# EAGLE schematic open-lux-m (EAGLE 6.5.0)
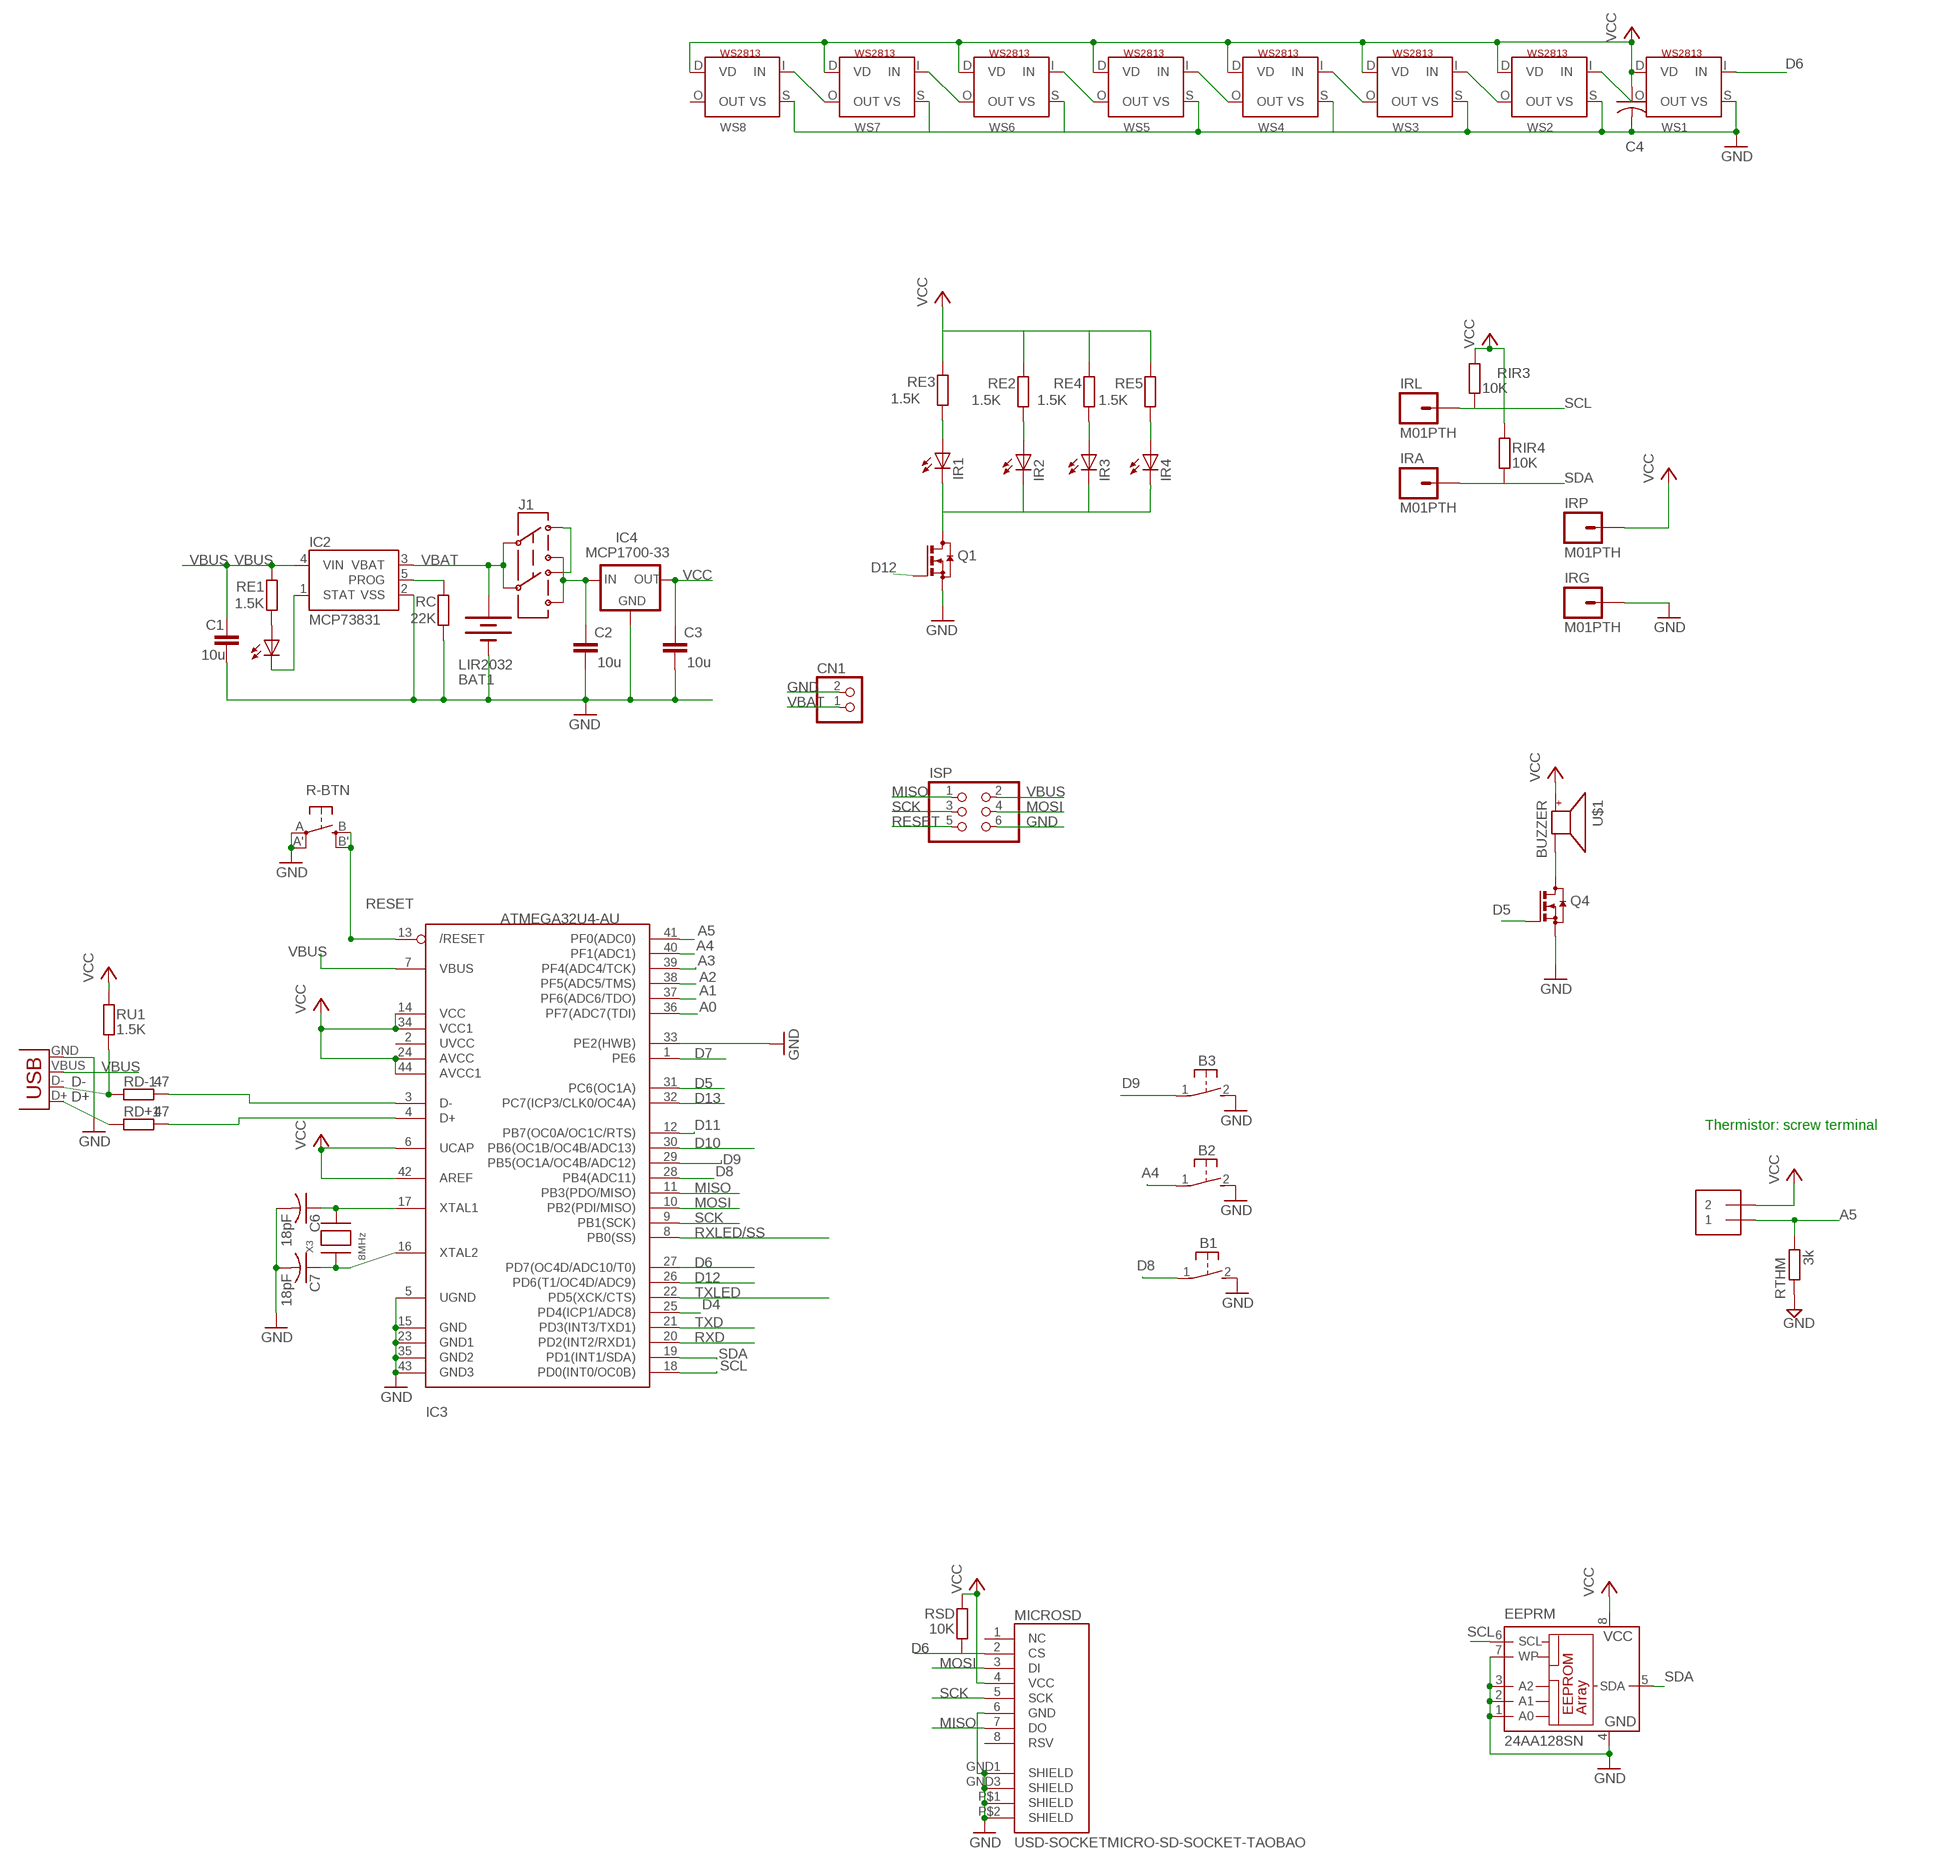
[diagram p0: schematic, sheet 1, part 1 of 2]
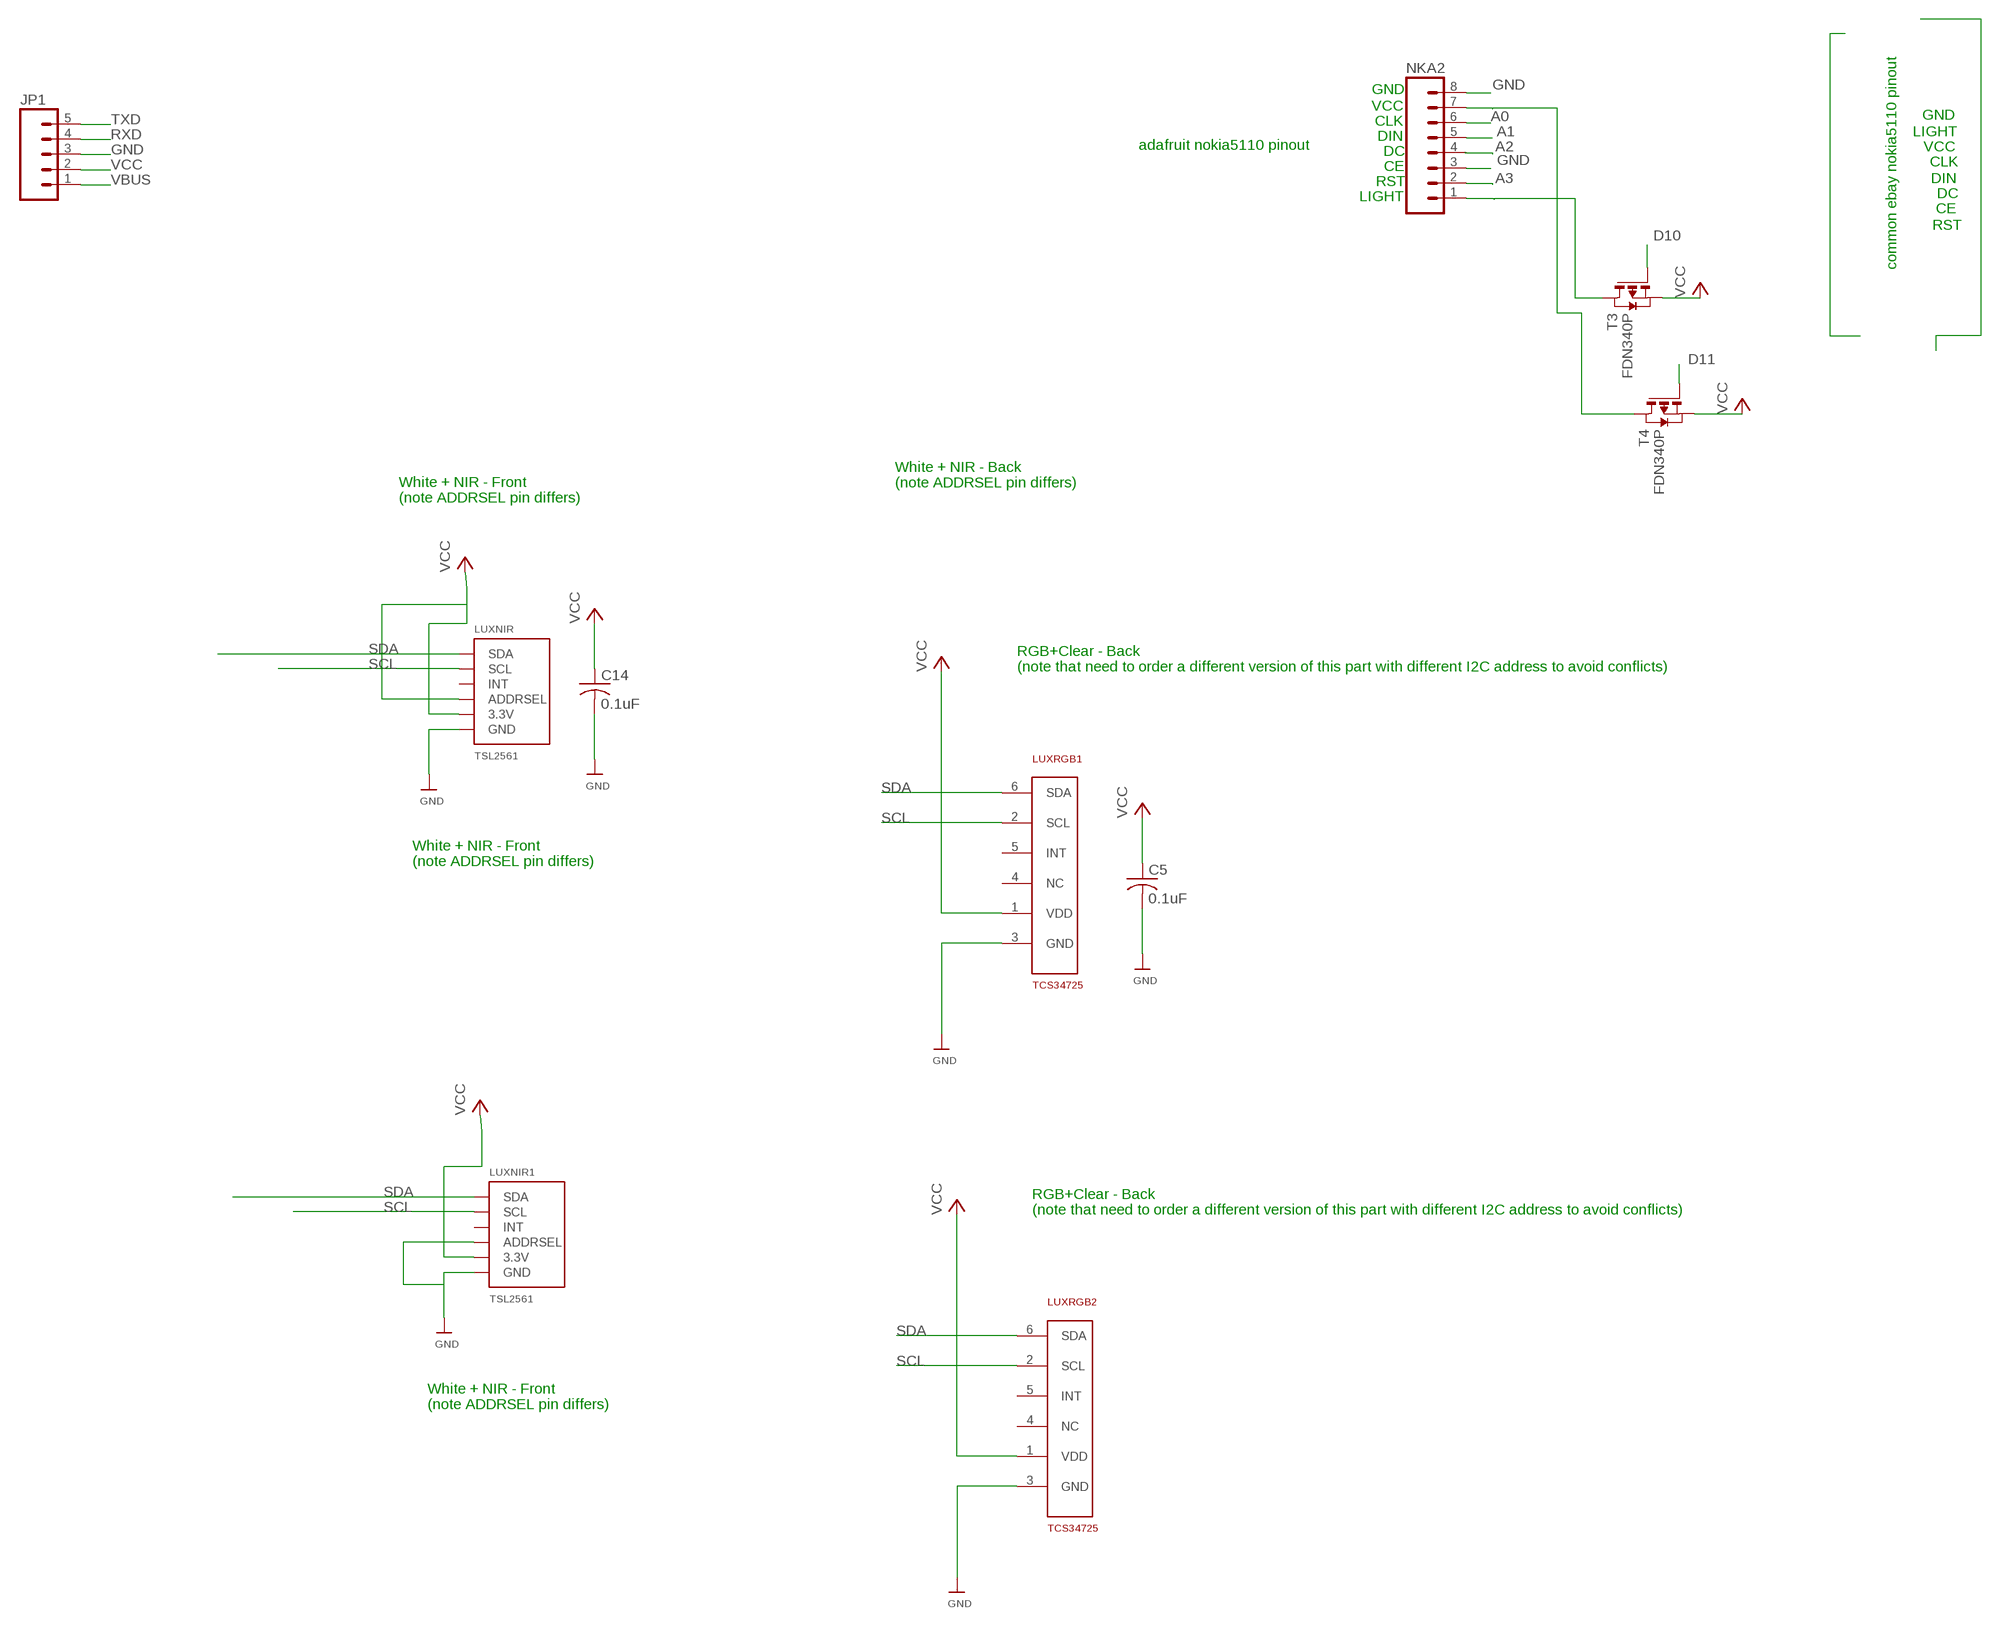
[diagram p1: schematic, sheet 1, part 2 of 2]

## Parts
B1  31-XX  [B3F-31XX]
B2  31-XX  [B3F-31XX]
B3  31-XX  [B3F-31XX]
BAT1  LIR2032  BATTERYBATTCOM_20MM_PTH_SMT  [BATTCOM_20MM_PTH_SMT]
C1  10u  C-EUC0805  [C0805]
C2  10u  C-EUC0805  [C0805]
C3  10u  C-EUC0805  [C0805]
C4  C-USC0805K  [C0805K]
C5  0.1uF  C-USC0805  [C0805]
C6  18pF  C-USC0805K  [C0805K]
C7  18pF  C-USC0805K  [C0805K]
C14  0.1uF  C-USC0805  [C0805]
CHARGE  0805  LEDCHIPLED_0805  [CHIPLED_0805]
CN1  JST_2PIN-SMT-RA  [JST-PH-2-SMT-RA]
EEPRM  24AA128SN  [SO-08]
IC2  MCP73831  [SOT23-5]
IC3  ATMEGA32U4-AU  [TQFP44]
IC4  MCP1700-33  MCP1700SOT233  [SOT23]
IR1  LEDCHIP-LED0603  [CHIP-LED0603]
IR2  LEDCHIP-LED0603  [CHIP-LED0603]
IR3  LEDCHIP-LED0603  [CHIP-LED0603]
IR4  LEDCHIP-LED0603  [CHIP-LED0603]
IRA  M01PTH  [1X01]
IRG  M01PTH  [1X01]
IRL  M01PTH  [1X01]
IRP  M01PTH  [1X01]
ISP  PINHD-2X3  [2X03]
J1  AYZ0202  [AYZ0202]
JP1  M05LOCK  [1X05_LOCK]
LUXNIR  TSL2561  [TSL2561_FN@1]
LUXNIR1  TSL2561  [TSL2561_FN@1]
LUXRGB1  TCS34725  [DFN-6]
LUXRGB2  TCS34725  [DFN-6]
MICROSD  USD-SOCKETMICRO-SD-SOCKET-TAOBAO  [MICRO-SD-SOCKET-TAOBAO]
NKA2  M08LOCK  [1X08_LOCK]
Q1  BSS123  [SOT23]
Q4  BSS123  [SOT23]
R-BTN  EVQQ2  [EVQ-Q2]
RC  22K  R-EU_R0805  [R0805]
RD+1  47  R-EU_R0805  [R0805]
RD-1  47  R-EU_R0805  [R0805]
RE1  1.5K  R-EU_R0805  [R0805]
RE2  1.5K  R-EU_R0805  [R0805]
RE3  1.5K  R-EU_R0805  [R0805]
RE4  1.5K  R-EU_R0805  [R0805]
RE5  1.5K  R-EU_R0805  [R0805]
RIR3  10K  R-EU_R0805  [R0805]
RIR4  10K  R-EU_R0805  [R0805]
RSD  10K  R-EU_R0805  [R0805]
RTHM  3k  R-EU_0204/7  [0204/7]
RU1  1.5K  R-EU_R0805  [R0805]
T3  FDN340P  PMOSSOT23  [SOT-23]
T4  FDN340P  PMOSSOT23  [SOT-23]
THM1  1X2-3.5MM  [1X2-3.5MM]
U$1  BUZZER  [SMT-8585-BUZZER]
WS1  WS2813  [RGBLED5050_4]
WS2  WS2813  [RGBLED5050_4]
WS3  WS2813  [RGBLED5050_4]
WS4  WS2813  [RGBLED5050_4]
WS5  WS2813  [RGBLED5050_4]
WS6  WS2813  [RGBLED5050_4]
WS7  WS2813  [RGBLED5050_4]
WS8  WS2813  [RGBLED5050_4]
X2  USBSMD  [USB-MINIB]
X3  8MHz  XTALNX5032  [NX5032]

## Nets
A0: IC3.36(PF7(ADC7(TDI)) NKA2.6
A1: IC3.37(PF6(ADC6/TDO)) NKA2.5
A2: IC3.38(PF5(ADC5/TMS))
A3: IC3.39(PF4(ADC4/TCK)) NKA2.2
A4: B2.1(P) IC3.40(PF1(ADC1))
A5: IC3.41(PF0(ADC0)) RTHM.2 THM1.1
D4: IC3.25(PD4(ICP1/ADC8))
D5: IC3.31(PC6(OC1A)) Q4.1(G)
D6: IC3.27(PD7(OC4D/ADC10/T0)) MICROSD.2(CS) RSD.1 WS1.I(IN)
D7: IC3.1(PE6)
D8: B1.1(P) IC3.28(PB4(ADC11))
D9: B3.1(P) IC3.29(PB5(OC1A/OC4B/ADC12))
D10: IC3.30(PB6(OC1B/OC4B/ADC13)) T3.3(G)
D11: IC3.12(PB7(OC0A/OC1C/RTS)) T4.3(G)
D12: IC3.26(PD6(T1/OC4D/ADC9)) Q1.1(G)
D13: IC3.32(PC7(ICP3/CLK0/OC4A))
D+: RD+1.1 X2.D+
D-: RD-1.1 RU1.1 X2.D-
GND: B1.2(S) B2.2(S) B3.2(S) BAT1.P$1(-) C1.2 C2.2 C3.2 C4.2 C5.2 C6.2 C7.2 C14.2 CN1.2 EEPRM.1(A0) EEPRM.2(A1) EEPRM.3(A2) EEPRM.4(GND) EEPRM.7(WP) IC2.2(VSS) IC3.5(UGND) IC3.15(GND) IC3.23(GND1) IC3.33(PE2(HWB)) IC3.35(GND2) IC3.43(GND3) IC4.1(GND) IRG.1 ISP.6 JP1.3 LUXNIR1.ADR(ADDRSEL) LUXNIR1.VSS(GND) LUXNIR.VSS(GND) LUXRGB1.3(GND) LUXRGB2.3(GND) MICROSD.6(GND) MICROSD.GND1(SHIELD) MICROSD.GND3(SHIELD) MICROSD.P$1(SHIELD) MICROSD.P$2(SHIELD) NKA2.3 NKA2.8 Q1.2(S) Q4.2(S) R-BTN.A'(P1) R-BTN.A(P) RC.1 RTHM.1 WS1.S(VS) WS2.S(VS) WS3.S(VS) WS4.S(VS) X2.GND
GND1: WS6.S(VS)
GND2: WS5.S(VS)
MISO: IC3.11(PB3(PDO/MISO)) ISP.1 MICROSD.7(DO)
MOSI: IC3.10(PB2(PDI/MISO)) ISP.4 MICROSD.3(DI)
N$1: J1.3 J1.6
N$2: C7.1 IC3.16(XTAL2) X3.P$1
N$3: C6.1 IC3.17(XTAL1) X3.P$2
N$5: CHARGE.C IC2.1(STAT)
N$6: IC2.5(PROG) RC.2
N$7: Q4.3(D) U$1.-
N$9: IR1.C IR2.C IR3.C IR4.C Q1.3(D)
N$10: CHARGE.A RE1.1
N$11: IR1.A RE3.1
N$12: NKA2.1 T3.1(D)
N$13: IR2.A RE2.1
N$14: WS6.O(OUT) WS7.I(IN)
N$15: IR3.A RE4.1
N$16: WS7.S(VS) WS8.S(VS)
N$17: IR4.A RE5.1
N$19: WS5.I(IN)
N$20: WS5.O(OUT) WS6.I(IN)
N$21: IC3.4(D+) RD+1.2
N$22: IC3.3(D-) RD-1.2
N$23: WS1.O(OUT) WS2.I(IN)
N$24: WS2.O(OUT) WS3.I(IN)
N$25: WS3.O(OUT) WS4.I(IN)
N$28: WS7.O(OUT) WS8.I(IN)
N$31: NKA2.7 T4.1(D)
RESET: IC3.13(/RESET) ISP.5 R-BTN.B'(S1) R-BTN.B(S)
RXD: IC3.20(PD2(INT2/RXD1)) JP1.4
RXLED/SS: IC3.8(PB0(SS))
SCK: IC3.9(PB1(SCK)) ISP.3 MICROSD.5(SCK)
SCL: EEPRM.6(SCL) IC3.18(PD0(INT0/OC0B)) IRL.1 LUXNIR1.CLK(SCL) LUXNIR.CLK(SCL) LUXRGB1.2(SCL) LUXRGB2.2(SCL) RIR3.1
SDA: EEPRM.5(SDA) IC3.19(PD1(INT1/SDA)) IRA.1 LUXNIR1.DATA(SDA) LUXNIR.DATA(SDA) LUXRGB1.6(SDA) LUXRGB2.6(SDA) RIR4.1
TXD: IC3.21(PD3(INT3/TXD1)) JP1.5
TXLED: IC3.22(PD5(XCK/CTS))
VBAT: BAT1.P$2(+) CN1.1 IC2.3(VBAT) J1.2 J1.5
VBUS: C1.1 IC2.4(VIN) IC3.7(VBUS) ISP.2 JP1.1 RE1.2 X2.VBUS
VCC: C3.1 C4.1 C5.1 C14.1 EEPRM.8(VCC) IC3.6(UCAP) IC3.14(VCC) IC3.24(AVCC) IC3.34(VCC1) IC3.42(AREF) IC3.44(AVCC1) IC4.2(OUT) IRP.1 JP1.2 LUXNIR1.VDD(3.3V) LUXNIR.ADR(ADDRSEL) LUXNIR.VDD(3.3V) LUXRGB1.1(VDD) LUXRGB2.1(VDD) MICROSD.4(VCC) RE2.2 RE3.2 RE4.2 RE5.2 RIR3.2 RIR4.2 RSD.2 RU1.2 T3.2(S) T4.2(S) THM1.2 U$1.+ WS1.D(VD) WS2.D(VD) WS3.D(VD) WS4.D(VD) WS5.D(VD) WS6.D(VD) WS7.D(VD) WS8.D(VD)
VDD: C2.1 IC4.3(IN) J1.1 J1.4
Unconnected: IC3.2(UVCC) LUXNIR1.INT LUXNIR.INT LUXRGB1.4(NC) LUXRGB1.5(INT) LUXRGB2.4(NC) LUXRGB2.5(INT) MICROSD.1(NC) MICROSD.8(RSV) NKA2.4 WS4.O(OUT) WS8.O(OUT)

## Notes on the sheet
- common ebay nokia5110 pinout
- GND
- VCC
- GND
- CLK
- adafruit nokia5110 pinout | LIGHT
- DIN
- VCC
- DC
- CLK
- CE
- RST | DIN
- LIGHT | DC
- CE
- RST
- White + NIR - Back
  (note ADDRSEL pin differs)
- White + NIR - Front
  (note ADDRSEL pin differs)
- RGB+Clear - Back 
  (note that need to order a different version of this part with different I2C address to avoid conflicts)
- White + NIR - Front
  (note ADDRSEL pin differs)
- Thermistor: screw terminal
- RGB+Clear - Back 
  (note that need to order a different version of this part with different I2C address to avoid conflicts)
- White + NIR - Front
  (note ADDRSEL pin differs)

## Library data of the parts
B1-B3 = adafruit:31-XX: OMRON SWITCH Now with beefier pads!
BAT1 = SparkFunNew:BATTERY: Battery Holders Various common sizes : AA, AAA, 20mm coin cell and 12mm coin cell.
C1-C3 = resistor:C-EU: CAPACITOR, European symbol
C4 = adafruit2013:C-US: CAPACITOR, American symbol
C5-C7 C14 = adafruit:C-US: CAPACITOR, American symbol
CHARGE = led:LED: LED
CN1 = adafruit:JST_2PIN: JST 2-Pin Connectors of various flavors SMT-RA (S2B-PH-SM4) 4UConnector #17311 SMT (B2B-PH-SM4) THM-RA (S2B-PH) THM (B2B-PH)
EEPRM = microchip:24*: Serial EEPROM I2C; MF: MICROCHIP; MPN: 24AA128-I/SN; OC_FARNELL: unknown; OC_NEWARK: 92C6842
IC2 = SparkFunNew:MCP73831: Microchip's MCP73831 Miniature single cell, fully integrated Li-Ion, Li-polymer charge management controller http://ww1.microchip.com/downloads/en/DeviceDoc/21984a.pdf
IC3 = adaprog:ATMEGA32U4
IC4 = adafruit:MCP1700: VOLTAGE REGULATOR
IR1-IR4 = adafruit:LED: LED
IRA IRG IRL IRP = SparkFun-Connectors:M01: Header 1 Standard 1-pin 0.1" header. Use with straight break away headers (SKU : PRT-00116), right angle break away headers (PRT-00553), swiss pins (PRT-00743), machine pins (PRT-00117), and female headers (PRT-00115).
ISP = pinhead:PINHD-2X3: PIN HEADER
J1 = SparkFunNew:AYZ0202: SPDT Slide Switch Simple SMD single-pull double-throw slide switch. Good for less than 350mA power switch, switching UARTs between devices, etc. Spark Fun Electronics SKU : COM-00597
JP1 = SparkFun-Connectors:M05: Header 5 Standard 5-pin 0.1" header. Use with straight break away headers (SKU : PRT-00116), right angle break away headers (PRT-00553), swiss pins (PRT-00743), machine pins (PRT-00117), and female headers (PRT-00115). Molex polarized connector foot print use with SKU : PRT-08230 with associated crimp pins and housings.
LUXNIR LUXNIR1 = microbuilder:TSL2561: TSL2561 Light-To-Digital Sensor Mouser Part Numbers: CS (obsolete): 856-TSL2561CS DFN (cheapest): 856-TSL2561FN
LUXRGB1 LUXRGB2 = dwbLibrary:TCS34725
MICROSD = SparkFunNew:USD-SOCKET: microSD Socket Push-push type uSD socket. Schematic element and footprint production proven. Spark Fun Electronics SKU : PRT-00127. tDoc lines correctly indicate media card edge positions when inserting (unlocked, locked, depressed).
NKA2 = SparkFun-Connectors:M08: Header 8 Standard 8-pin 0.1" header. Use with straight break away headers (SKU : PRT-00116), right angle break away headers (PRT-00553), swiss pins (PRT-00743), machine pins (PRT-00117), and female headers (PRT-00115).
Q1 Q4 = transistor-small-signal:BSS123: N-CHANNEL MOS FET
R-BTN = adafruit:EVQQ2: SMT 6mm switch, EVQQ2 series http://www.ladyada.net/library/eagle
RC RD+1 RD-1 RE1-RE5 RIR3 RIR4 RSD RTHM RU1 = rcl:R-EU_: RESISTOR, European symbol
T3 T4 = zetex:PMOSSOT23: MOS FET
THM1 = adafruit:1X2: 3.5mm Terminal block http://www.ladyada.net/library/pcb/eaglelibrary.html
U$1 = adafruit:BUZZER
WS1-WS8 = adafruit:WS2813
X2 = SparkFun:USB: USB Connectors USB-B-PTH is fully proven SKU : PRT-00139 USB-miniB is fully proven SKU : PRT-00587 USB-A-PCB is untested. USB-A-H is throughly reviewed, but untested. Spark Fun Electronics SKU : PRT-00437 USB-B-SMT is throughly reviewed, but untested. Needs silkscreen touching up. USB-A-S has not been used/tested USB-MB-H has not been used/tested
X3 = adaprog:XTAL

## Net classes
0 default: width 0.406 mm, clearance 0.203 mm
1 power: width 0.254 mm, clearance 0.203 mm